# Altium schematic sheet Sheet2.SchDoc
size 420 x 297 mm; SheetNumber: 2; SheetTotal: 3
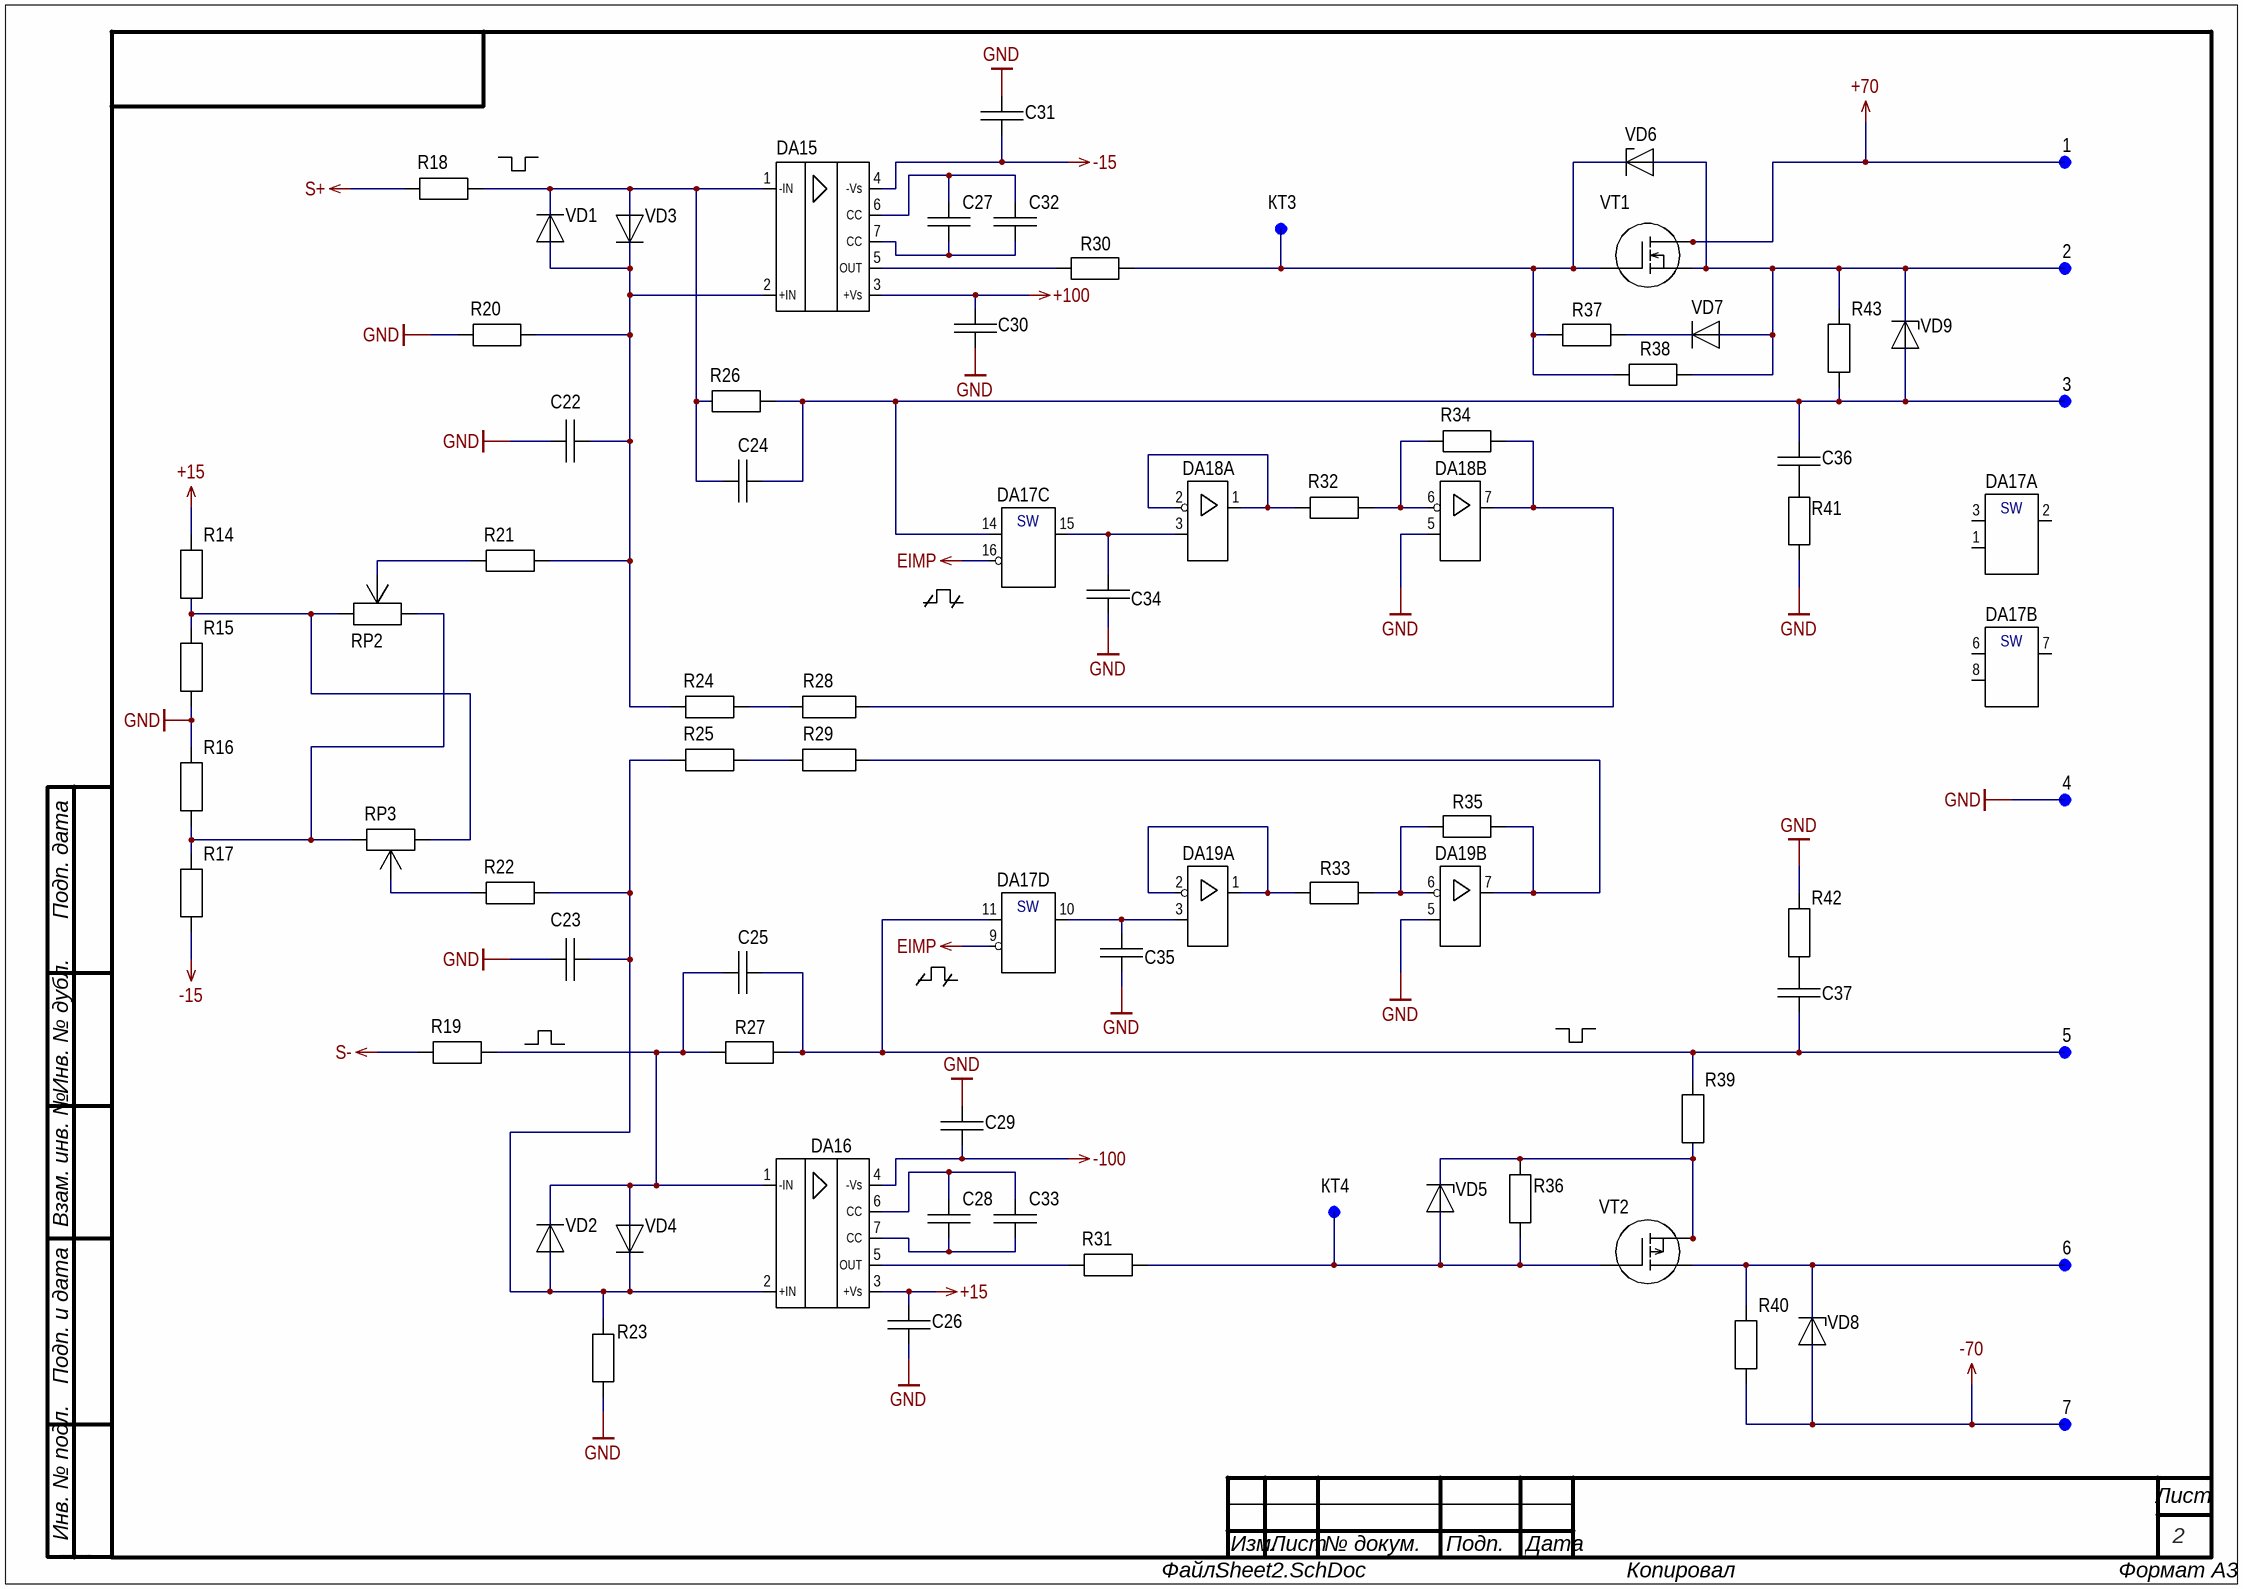
[diagram p0: Sheet2.SchDoc]

## Parts
1  OTV  (value not drawn)
2  OTV  (value not drawn)
3  OTV  (value not drawn)
4  OTV  (value not drawn)
5  OTV  (value not drawn)
6  OTV  (value not drawn)
7  OTV  (value not drawn)
C22  2220-X7R-250 В-1 мкФ +-10%  [CAP: 2220]  (value not drawn)
C23  2220-X7R-250 В-1 мкФ +-10%  [CAP: 2220]  (value not drawn)
C24  0805-C0G-250 В-10 пФ +-5%  [CAP: 0805]  (value not drawn)
C25  0805-C0G-250 В-10 пФ +-5%  [CAP: 0805]  (value not drawn)
C26  0805-X7R-25 В-1 мкФ +-10%  [CAP: 0805]  (value not drawn)
C27  0805-C0G-250 В-10 пФ +-5%  [CAP: 0805]  (value not drawn)
C28  0805-C0G-250 В-10 пФ +-5%  [CAP: 0805]  (value not drawn)
C29  2220-X7R-250 В-1 мкФ +-10%  [CAP: 2220]  (value not drawn)
C30  2220-X7R-250 В-1 мкФ +-10%  [CAP: 2220]  (value not drawn)
C31  0805-X7R-25 В-1 мкФ +-10%  [CAP: 0805]  (value not drawn)
C32  0805-C0G-250 В-10 пФ +-5%  [CAP: 0805]  (value not drawn)
C33  0805-C0G-250 В-10 пФ +-5%  [CAP: 0805]  (value not drawn)
C34  К73-17-160 В-1 мкФ +-10%  [К73-17-A15]  (value not drawn)
C35  К73-17-160 В-1 мкФ +-10%  [К73-17-A15]  (value not drawn)
C36  1206-X7R-250 B-0,1 мкФ+-10%  [CAP: 1206]  (value not drawn)
C37  1206-X7R-250 B-0,1 мкФ+-10%  [CAP: 1206]  (value not drawn)
DA15  PA340CC  [D2PAK (TO263-7-1)]  (value not drawn)
DA16  PA340CC  [D2PAK (TO263-7-1)]  (value not drawn)
DA17  ADG433BR  [16-SOIC]  (value not drawn)  (parts A,B,C,D of 5)
DA18  AD823ARZ  [8-SOIC]  (value not drawn)  (parts A,B of 3)
DA19  AD823ARZ  [8-SOIC]  (value not drawn)  (parts A,B of 3)
R14  1206-15 кОм+-5%  [1206]  (value not drawn)
R15  1206-51 Ом+-5%  [1206]  (value not drawn)
R16  1206-51 Ом+-5%  [1206]  (value not drawn)
R17  1206-51 кОм+-5%  [1206]  (value not drawn)
R18  1206-2 кОм+-0.5%  [1206]  (value not drawn)
R19  1206-2 кОм+-0.5%  [1206]  (value not drawn)
R20  1206-2 кОм+-0.5%  [1206]  (value not drawn)
R21  1206-2 кОм+-0.5%  [1206]  (value not drawn)
R22  1206-2 кОм+-0.5%  [1206]  (value not drawn)
R23  1206-2 кОм+-0.5%  [1206]  (value not drawn)
R24  1206-10 кОм+-0,5%  [1206]  (value not drawn)
R25  1206-10 кОм+-0,5%  [1206]  (value not drawn)
R26  1206-20 кОм+-0.5%  [1206]  (value not drawn)
R27  1206-20 кОм+-0.5%  [1206]  (value not drawn)
R28  С2-33Н-0,125-1,5 кОм +-5%  [RES_AXIAL_VERTICAL_5mm]  (value not drawn)
R29  С2-33Н-0,125-1,5 кОм +-5%  [RES_AXIAL_VERTICAL_5mm]  (value not drawn)
R30  1206-2,4 кОм+-5%  [1206]  (value not drawn)
R31  1206-2,4 кОм+-5%  [1206]  (value not drawn)
R32  1206-20 кОм+-0.5%  [1206]  (value not drawn)
R33  1206-20 кОм+-0.5%  [1206]  (value not drawn)
R34  1206-20 кОм+-0.5%  [1206]  (value not drawn)
R35  1206-20 кОм+-0.5%  [1206]  (value not drawn)
R36  1206-2,4 кОм+-5%  [1206]  (value not drawn)
R37  1206-51 Ом+-5%  [1206]  (value not drawn)
R38  1206-2,4 кОм+-5%  [1206]  (value not drawn)
R39  1206-51 Ом+-5%  [1206]  (value not drawn)
R40  2512-51 Ом+-5%  [2512]  (value not drawn)
R41  2512-51 Ом+-5%  [2512]  (value not drawn)
R42  2512-51 Ом+-5%  [2512]  (value not drawn)
R43  2512-51 Ом+-5%  [2512]  (value not drawn)
RP2  PVG3A102C01R00  [PVG3A]  (value not drawn)
RP3  PVG3A102C01R00  [PVG3A]  (value not drawn)
VD1  1N4148  [DO-35 vertical]  (value not drawn)
VD2  1N4148  [DO-35 vertical]  (value not drawn)
VD3  1N4148  [DO-35 vertical]  (value not drawn)
VD4  1N4148  [DO-35 vertical]  (value not drawn)
VD5  BZX84C15LT1G  [SOT-23-3]  (value not drawn)
VD6  BZX84C15LT1G  [SOT-23-3]  (value not drawn)
VD7  1N4148  [DO-35 vertical]  (value not drawn)
VD8  BZX84C15LT1G  [SOT-23-3]  (value not drawn)
VD9  BZX84C15LT1G  [SOT-23-3]  (value not drawn)
VT1  ZXMN10A08E6TA  [SOT-23-6]  (value not drawn)
VT2  ZXMP10A17E6TA  [SOT-23-6]  (value not drawn)
КТ3  Lepestok  [LEPESTOK7750224]  (value not drawn)
КТ4  Lepestok  [LEPESTOK7750224]  (value not drawn)

## Nets
+15: C26.2 DA16.3(+Vs) R14.2
+70: 1.?1 VT1.1(D) VT1.2(D) VT1.5(D) VT1.6(D)
+100: C30.2 DA15.3(+Vs)
-15: C31.1 DA15.4(-Vs) R17.1
-70: 7.?1 R40.1 VD8.1
-100: C29.1 DA16.4(-Vs)
EIMP: DA17.9(IN3) DA17.16(IN2)
GND: 4.?1 C22.1 C23.1 C26.1 C29.2 C30.1 C31.2 C34.1 C35.1 DA18.5(+IN2) DA19.5(+IN2) R15.1 R16.2 R20.1 R23.1 R41.2 R42.2
S+: R18.1
S-: R19.1
Net2_?1: 2.?1 R38.2 R43.2 VD6.1 VD7.1 VD9.3 VT1.4(S)
Net3_?1: 3.?1 C24.2 C36.2 DA17.14(S2) R26.2 R43.1 VD9.1
Net5_?1: 5.?1 C25.2 C37.2 DA17.11(S3) R27.2 R39.2
Net6_?1: 6.?1 R40.2 VD8.3 VT2.4(S)
NetC22_2: C22.2 DA15.2(+IN) R20.2 R21.2 R24.1 VD1.1 VD3.2
NetC23_2: C23.2 DA16.2(+IN) R22.2 R23.2 R25.1 VD2.1 VD4.2
NetC24_1: C24.1 DA15.1(-IN) R18.2 R26.1 VD1.2 VD3.1
NetC25_1: C25.1 DA16.1(-IN) R19.2 R27.1 VD2.2 VD4.1
NetC27_1: C27.1 C32.1 DA15.7(СС)
NetC27_2: C27.2 C32.2 DA15.6(СС)
NetC28_1: C28.1 C33.1 DA16.7(СС)
NetC28_2: C28.2 C33.2 DA16.6(СС)
NetC34_2: C34.2 DA17.15(D2) DA18.3(+IN1)
NetC35_2: C35.2 DA17.10(D3) DA19.3(+IN1)
NetC36_1: C36.1 R41.1
NetC37_1: C37.1 R42.1
NetDA15_5: DA15.5(OUT) R30.1
NetDA16_5: DA16.5(OUT) R31.1
NetDA18_1: DA18.1(OUT1) DA18.2(-IN1) R32.1
NetDA18_6: DA18.6(-IN2) R32.2 R34.1
NetDA18_7: DA18.7(OUT2) R28.2 R34.2
NetDA19_1: DA19.1(OUT1) DA19.2(-IN1) R33.1
NetDA19_6: DA19.6(-IN2) R33.2 R35.1
NetDA19_7: DA19.7(OUT2) R29.2 R35.2
NetR14_1: R14.1 R15.2 RP2.3 RP3.3
NetR16_1: R16.1 R17.2 RP2.1 RP3.1
NetR21_1: R21.1 RP2.2(WIPER)
NetR22_1: R22.1 RP3.2(WIPER)
NetR24_2: R24.2 R28.1
NetR25_2: R25.2 R29.1
NetR30_2: R30.2 R37.1 R38.1 VD6.3 VT1.3(G) КТ3.1
NetR31_2: R31.2 R36.1 VD5.1 VT2.3(G) КТ4.1
NetR36_2: R36.2 R39.1 VD5.3 VT2.1(D) VT2.2(D) VT2.5(D) VT2.6(G)
NetR37_2: R37.2 VD7.2

Not connected (* = marked no-connect by the designer): DA17 1(IN1) 2(D1) 3(S1) 6(S4) 7(D4) 8(IN4)

## Notes on the sheet
- Подп. дата
- Инв. № дубл.
- Взам. инв. №
- Подп. и дата
- Инв. № подл.
- Изм.
- Лист
- № докум.
- Подп.
- Дата
- ALTIUM GOSTBOM2.0 KEV
- Файл:
- Копировал
- Формат А3
- (in symbol ADG433BR, part A) SW
- (in symbol ADG433BR, part B) SW
- (in symbol ADG433BR, part C) SW
- (in symbol ADG433BR, part D) SW

## Library data of the parts
C22 C23 C29 C30 = 2220-X7R-250 В-1 мкФ +-10%: Value: 1 мкФ
C24 C25 C27 C28 C32 C33 = 0805-C0G-250 В-10 пФ +-5%: Value: 10 пФ
C26 C31 = 0805-X7R-25 В-1 мкФ +-10%: Value: 1 мкФ
C36 C37 = 1206-X7R-250 B-0,1 мкФ+-10%: Value: 2,2 пФ
DA15 DA16 = PA340CC: High Voltage Power Operational Amplifier
DA17 = ADG433BR: LC2MOS Precision Quad SPST Switches; Value: *
DA18 DA19 = AD823ARZ: Dual, 16 MHz, Rail-to-Rail / FET Input Amplifier / 8-SOIC
R14 = 1206-15 кОм+-5%: Value: 15 кОм; ModelPrint: 1206
R15 R16 R37 R39 = 1206-51 Ом+-5%: Value: 51 Ом; ModelPrint: 1206
R17 = 1206-51 кОм+-5%: Value: 51 кОм; ModelPrint: 1206
R18-R23 = 1206-2 кОм+-0.5%: Value: 2 кОм; ModelPrint: 1206
R24 R25 = 1206-10 кОм+-0,5%: Value: 10 кОм; ModelPrint: 1206
R26 R27 R32-R35 = 1206-20 кОм+-0.5%: Value: 20 кОм; ModelPrint: 1206
R28 R29 = С2-33Н-0,125-1,5 кОм +-5%: Резисторы постоянные непроволочные общего применения С2-33Н АИ, производитель "АО"НПО"ЭРКОН"; Номинальная мощность рассеяния: 0,125 Вт; Диапазон значений номинальных сопротивлений: от 1 Ом до 3,01 МОм; Ряд сопротивлений: Е24, Е96; Категории качества: «ОТК»; ТУ: ОЖО.467.173 ТУ; Value: *
R30 R31 R36 R38 = 1206-2,4 кОм+-5%: Value: 2,4 кОм; ModelPrint: 1206
R40-R43 = 2512-51 Ом+-5%: Value: 51 Ом; ModelPrint: 2512
VD1-VD4 VD7 = 1N4148: Диод 1N4148; Value: *
VT1 = ZXMN10A08E6TA: MOSFET, N, SOT-23-6; Transistor Type: MOSFET; Transistor Polarity: N; Voltage, Vds Typ: 100V; Current, Id Cont: 1.5A;
VT2 = ZXMP10A17E6TA: P-Channel 100 V 0.35 Ohm Power MOSFET Surface Mount - SOT-23-6